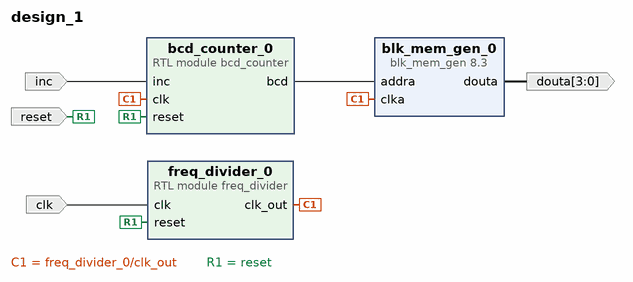
[diagram p0: block diagram of the top level]
# Vivado block design design_1, xc7z010clg400-1, Vivado 2016.4
create_bd_design design_1

create_bd_port -dir I -type clk clk
create_bd_port -dir I -type rst reset
create_bd_port -dir I inc
create_bd_port -dir O -from 3 -to 0 douta

create_bd_cell -type module -reference bcd_counter bcd_counter_0
create_bd_cell -type module -reference freq_divider freq_divider_0
set_property -dict {CONFIG.FREQ 125000000} [get_bd_cells freq_divider_0]
create_bd_cell -type ip -vlnv xilinx.com:ip:blk_mem_gen:8.3 blk_mem_gen_0
set_property -dict [list \
  CONFIG.Memory_Type Single_Port_ROM \
  CONFIG.Enable_32bit_Address false \
  CONFIG.Write_Width_A 4 \
  CONFIG.Enable_A Always_Enabled \
  CONFIG.Register_PortA_Output_of_Memory_Primitives true \
  CONFIG.Load_Init_File true \
  CONFIG.Coe_File ../../../../../../init_mem.coe \
  CONFIG.Use_RSTA_Pin false \
  CONFIG.Port_A_Write_Rate 0 \
  CONFIG.Port_B_Clock 0 \
  CONFIG.Port_B_Write_Rate 0 \
  CONFIG.Port_B_Enable_Rate 0 \
  CONFIG.use_bram_block Stand_Alone \
] [get_bd_cells blk_mem_gen_0]

# ---- connections ----

connect_bd_net [get_bd_pins freq_divider_0/clk_out] [get_bd_pins bcd_counter_0/clk] [get_bd_pins blk_mem_gen_0/clka]
connect_bd_net [get_bd_ports clk] [get_bd_pins freq_divider_0/clk]
connect_bd_net [get_bd_ports reset] [get_bd_pins freq_divider_0/reset] [get_bd_pins bcd_counter_0/reset]
connect_bd_net [get_bd_ports inc] [get_bd_pins bcd_counter_0/inc]
connect_bd_net [get_bd_pins bcd_counter_0/bcd] [get_bd_pins blk_mem_gen_0/addra]
connect_bd_net [get_bd_pins blk_mem_gen_0/douta] [get_bd_ports douta]

validate_bd_design
save_bd_design
